# EAGLE design mainboard (EAGLE 9.6.2)
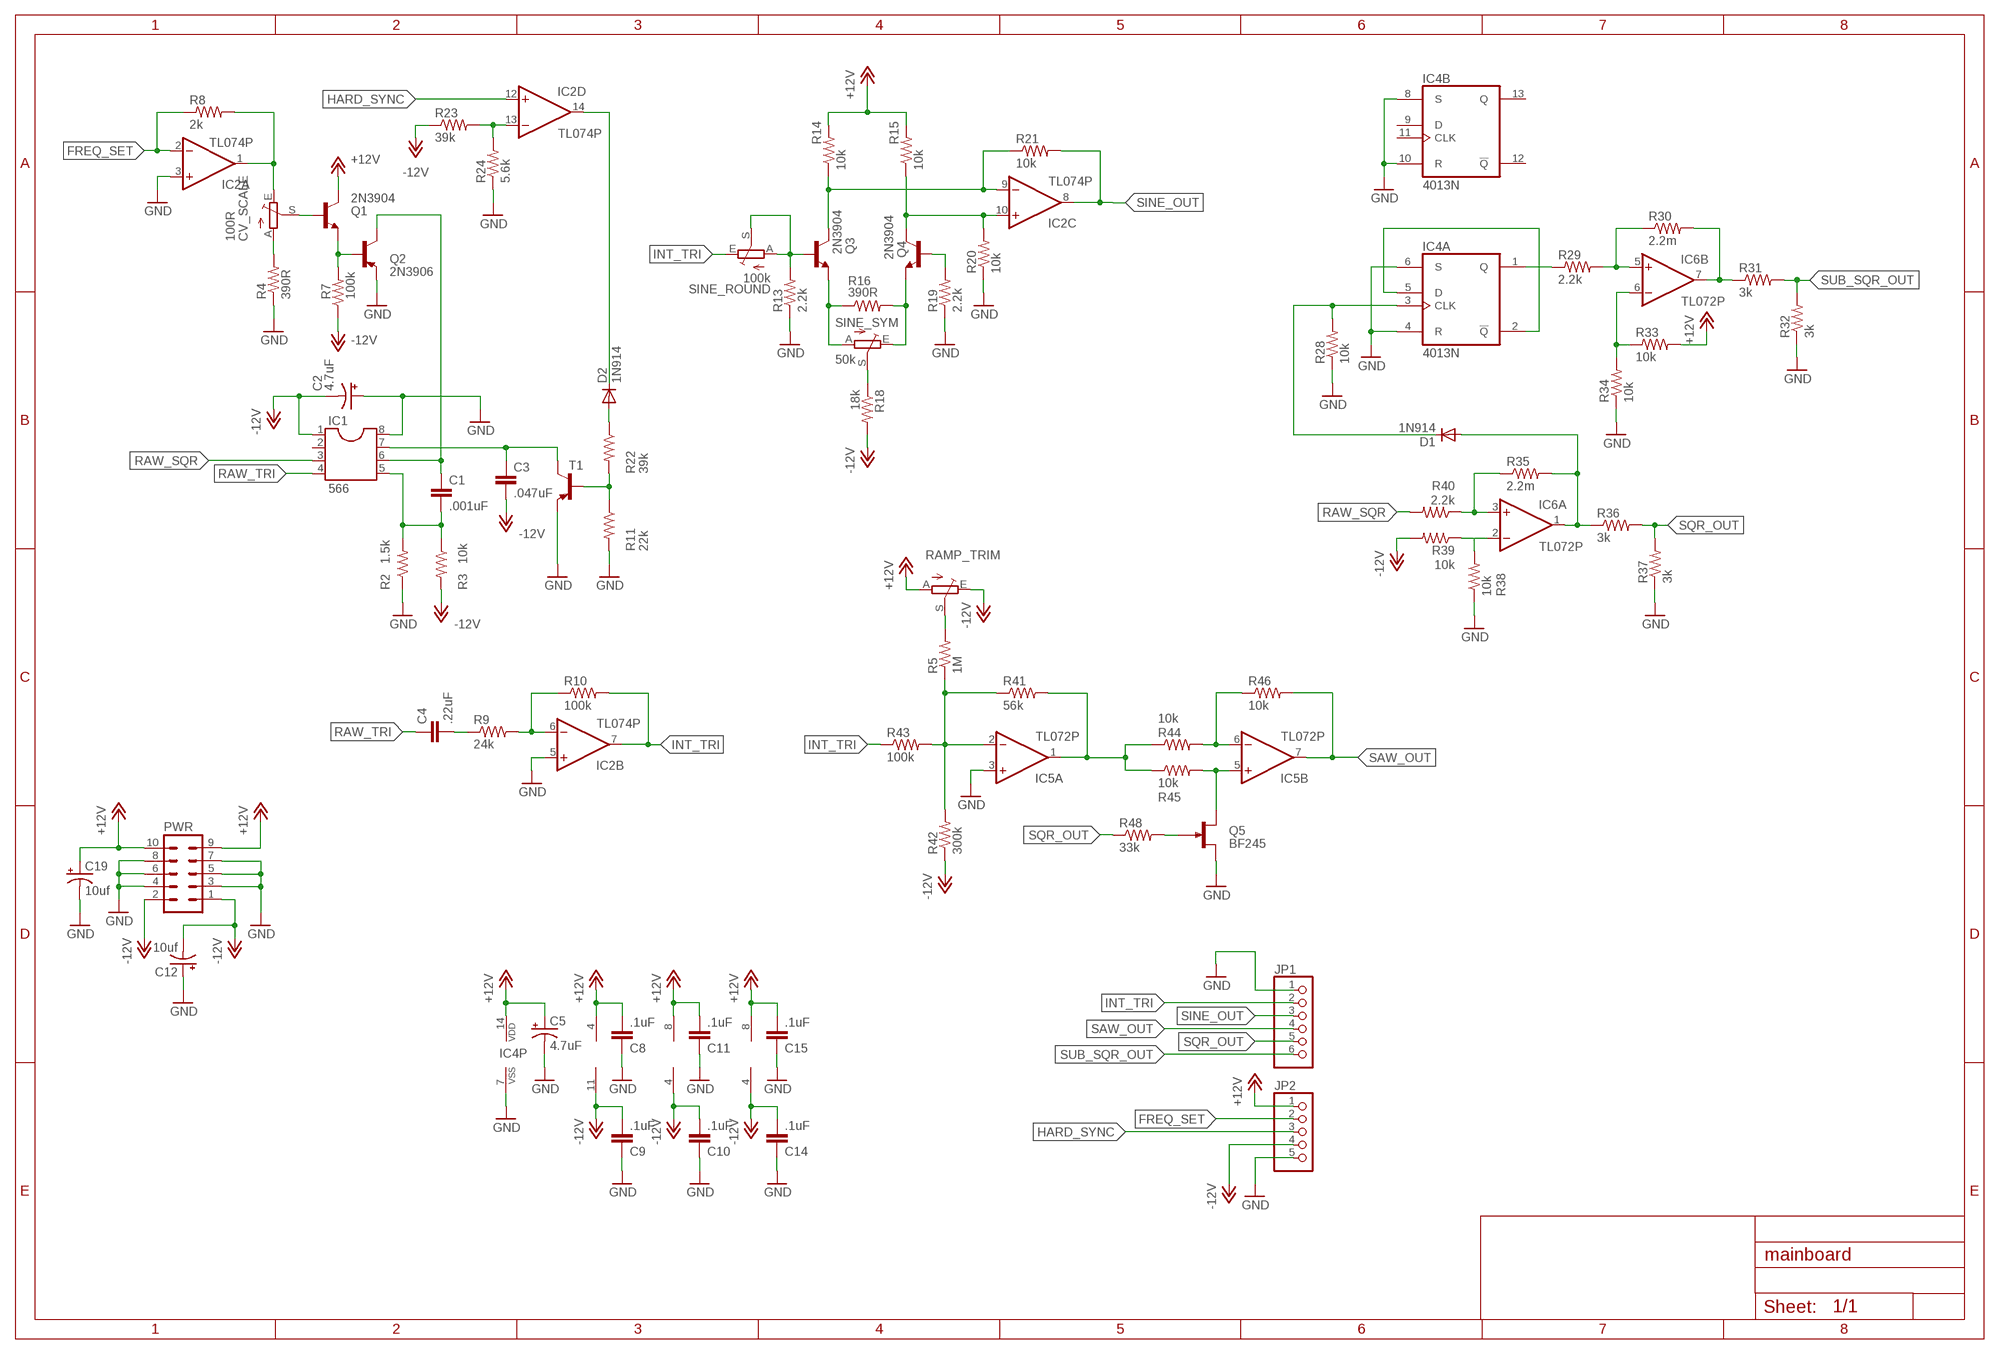
[diagram p0: schematic, sheet 1]

## Parts
C1  .001uF  C-EU050-024X044  [C050-024X044]
C2  4.7uF  CPOL-USE2.5-6  [E2,5-6]
C3  .047uF  C-EU050-024X044  [C050-024X044]
C4  .22uF  C-EU050-024X044  [C050-024X044]
C5  4.7uF  CPOL-USE2.5-5  [E2,5-5]
C8  .1uF  C-EU050-024X044  [C050-024X044]
C9  .1uF  C-EU050-024X044  [C050-024X044]
C10  .1uF  C-EU050-024X044  [C050-024X044]
C11  .1uF  C-EU050-024X044  [C050-024X044]
C12  10uf  CPOL-USE2.5-5  [E2,5-5]
C14  .1uF  C-EU050-024X044  [C050-024X044]
C15  .1uF  C-EU050-024X044  [C050-024X044]
C19  10uf  CPOL-USE2.5-5  [E2,5-5]
CV_SCALE  100R  TRIM_EU-RJ9W  [RJ9W]
D1  1N914  1N4148DO35-7  [DO35-7]
D2  1N914  1N4148DO35-7  [DO35-7]
IC1  566  DIL8  [DIL08]
IC2  TL074P  [DIL14]
IC4  4013N  [DIL14]
IC5  TL072P  [DIL08]
IC6  TL072P  [DIL08]
JP1  PINHD-1X6  [1X06]
JP2  PINHD-1X5  [1X05]
PWR  ML10  [ML10]
Q1  2N3904  [TO92]
Q2  2N3906  [TO92]
Q3  2N3904  [TO92]
Q4  2N3904  [TO92]
Q5  BF245  [SOT54C]
R2  1.5k  R-US_0204/7  [0204/7]
R3  10k  R-US_0204/7  [0204/7]
R4  390R  R-US_0204/7  [0204/7]
R5  1M  R-US_0204/7  [0204/7]
R7  100k  R-US_0204/7  [0204/7]
R8  2k  R-US_0204/7  [0204/7]
R9  24k  R-US_0204/7  [0204/7]
R10  100k  R-US_0204/7  [0204/7]
R11  22k  R-US_0204/7  [0204/7]
R13  2.2k  R-US_0204/7  [0204/7]
R14  10k  R-US_0204/7  [0204/7]
R15  10k  R-US_0204/7  [0204/7]
R16  390R  R-US_0204/7  [0204/7]
R18  18k  R-US_0204/7  [0204/7]
R19  2.2k  R-US_0204/7  [0204/7]
R20  10k  R-US_0204/7  [0204/7]
R21  10k  R-US_0204/7  [0204/7]
R22  39k  R-US_0204/7  [0204/7]
R23  39k  R-US_0204/7  [0204/7]
R24  5.6k  R-US_0204/7  [0204/7]
R28  10k  R-US_0204/7  [0204/7]
R29  2.2k  R-US_0204/7  [0204/7]
R30  2.2m  R-US_0204/7  [0204/7]
R31  3k  R-US_0204/7  [0204/7]
R32  3k  R-US_0204/7  [0204/7]
R33  10k  R-US_0204/7  [0204/7]
R34  10k  R-US_0204/7  [0204/7]
R35  2.2m  R-US_0204/7  [0204/7]
R36  3k  R-US_0204/7  [0204/7]
R37  3k  R-US_0204/7  [0204/7]
R38  10k  R-US_0204/7  [0204/7]
R39  10k  R-US_0204/7  [0204/7]
R40  2.2k  R-US_0204/7  [0204/7]
R41  56k  R-US_0204/7  [0204/7]
R42  300k  R-US_0204/7  [0204/7]
R43  100k  R-US_0204/7  [0204/7]
R44  10k  R-US_0204/7  [0204/7]
R45  10k  R-US_0204/7  [0204/7]
R46  10k  R-US_0204/7  [0204/7]
R48  33k  R-US_0204/7  [0204/7]
RAMP_TRIM  TRIM_EU-RJ9W  [RJ9W]
SINE_ROUND  100k  TRIM_EU-RJ9W  [RJ9W]
SINE_SYM  50k  TRIM_EU-RJ9W  [RJ9W]
T1  2N3906-PNP-TO92-EBC  [TO92-EBC]

## Nets
+12V: C5.+ C8.2 C11.2 C15.2 C19.+ IC2.4(P:V+) IC4.14(P:VDD) IC5.8(P:V+) IC6.8(P:V+) JP2.1 PWR.9 PWR.10 Q1.1(C) R14.2 R15.2 R33.2 RAMP_TRIM.A
-12V: C2.- C3.2 C9.2 C10.2 C12.- C14.2 IC1.1 IC2.11(P:V-) IC5.4(P:V-) IC6.4(P:V-) JP2.4 PWR.1 PWR.2 R3.2 R7.1 R18.2 R23.1 R39.2 R42.1 RAMP_TRIM.E
FREQ_SET: IC2.2(A:-IN) JP2.2 R8.1
GND: C2.+ C5.- C8.1 C9.1 C10.1 C11.1 C12.+ C14.1 C15.1 C19.- IC1.8 IC2.3(A:+IN) IC2.5(B:+IN) IC4.4(A:R) IC4.6(A:S) IC4.7(P:VSS) IC4.8(B:S) IC4.10(B:R) IC5.3(A:+IN) JP1.1 JP2.5 PWR.3 PWR.4 PWR.5 PWR.6 PWR.7 PWR.8 Q2.3(E) Q5.S R2.1 R4.1 R11.2 R13.1 R19.1 R20.1 R24.1 R28.1 R32.1 R34.1 R37.1 R38.1 T1.E
HARD_SYNC: IC2.12(D:+IN) JP2.3
INT_TRI: IC2.7(B:OUT) JP1.2 R10.2 R43.1 SINE_ROUND.E
N$1: C3.1 IC1.7 T1.C
N$2: C1.2 IC1.5 R2.2 R3.1
N$3: C1.1 IC1.6 Q2.1(C)
N$4: CV_SCALE.A R4.2
N$5: Q1.3(E) Q2.2(B) R7.2
N$6: CV_SCALE.S Q1.2(B)
N$7: CV_SCALE.E IC2.1(A:OUT) R8.2
N$8: IC2.6(B:-IN) R9.2 R10.1
N$9: C4.2 R9.1
N$10: IC5.6(B:-IN) R44.2 R46.1
N$11: R11.1 R22.2 T1.B
N$12: IC4.1(A:Q) R29.1
N$13: IC2.10(C:+IN) Q4.1(C) R15.1 R20.2
N$14: R18.1 SINE_SYM.S
N$15: Q3.2(B) R13.2 SINE_ROUND.A SINE_ROUND.S
N$16: IC2.9(C:-IN) Q3.1(C) R14.1 R21.1
N$17: Q4.2(B) R19.2
N$18: Q3.3(E) R16.1 SINE_SYM.A
N$19: Q4.3(E) R16.2 SINE_SYM.E
N$20: D2.C IC2.14(D:OUT)
N$21: IC6.5(B:+IN) R29.2 R30.1
N$22: D2.A R22.1
N$23: R5.2 RAMP_TRIM.S
N$24: IC6.6(B:-IN) R33.1 R34.2
N$25: IC4.2(A:!Q) IC4.5(A:D)
N$26: D1.C IC4.3(A:CLK) R28.2
N$27: IC6.7(B:OUT) R30.2 R31.1
N$28: IC5.2(A:-IN) R5.1 R41.1 R42.2 R43.2
N$29: D1.A IC6.1(A:OUT) R35.2 R36.1
N$30: IC2.13(D:-IN) R23.2 R24.2
N$31: IC6.2(A:-IN) R38.2 R39.1
N$32: IC6.3(A:+IN) R35.1 R40.1
N$33: IC5.1(A:OUT) R41.2 R44.1 R45.1
N$34: IC5.5(B:+IN) Q5.D R45.2
N$36: Q5.G R48.2
RAW_SQR: IC1.3 R40.2
RAW_TRI: C4.1 IC1.4
SAW_OUT: IC5.7(B:OUT) JP1.4 R46.2
SINE_OUT: IC2.8(C:OUT) JP1.3 R21.2
SQR_OUT: JP1.5 R36.2 R37.2 R48.1
SUB_SQR_OUT: JP1.6 R31.2 R32.2
Unconnected: IC1.2 IC4.9(B:D) IC4.11(B:CLK) IC4.12(B:!Q) IC4.13(B:Q)

## Library data of the parts
C1 C3 C4 C8-C11 C14 C15 = resistor:C-EU: CAPACITOR, European symbol
C2 C5 C12 C19 = resistor:CPOL-US: POLARIZED CAPACITOR, American symbol
CV_SCALE RAMP_TRIM SINE_ROUND SINE_SYM = pot:TRIM_EU-: POTENTIOMETER
D1 D2 = diode:1N4148: DIODE high speed (Philips)
IC1 = ic-package:DIL8: Dual In Line / Socket
IC2 = linear:TL074: OP AMP
IC4 = 40xx:4013: Dual D FLIP FLOP, set/reset
IC5 IC6 = TomW:TL072: OP AMP
JP1 = pinhead:PINHD-1X6: PIN HEADER
JP2 = pinhead:PINHD-1X5: PIN HEADER
PWR = con-ml:ML10: HARTING; OC_FARNELL: unknown; OC_NEWARK: unknown
Q1 Q3 Q4 = transistor-npn:2N3904: NPN Transistor
Q2 = transistor-pnp:2N3906: PNP Transistor
Q5 = transistor-small-signal:BF245: N-CHANNEL FET http://www.onsemi.com/pub/Collateral/BF245A-D.PDF
R2-R5 R7-R11 R13-R16 R18-R24 R28-R46 R48 = resistor:R-US_: RESISTOR, American symbol
T1 = transistor-neu-to92:*-PNP-: PNP Transistror

## Board
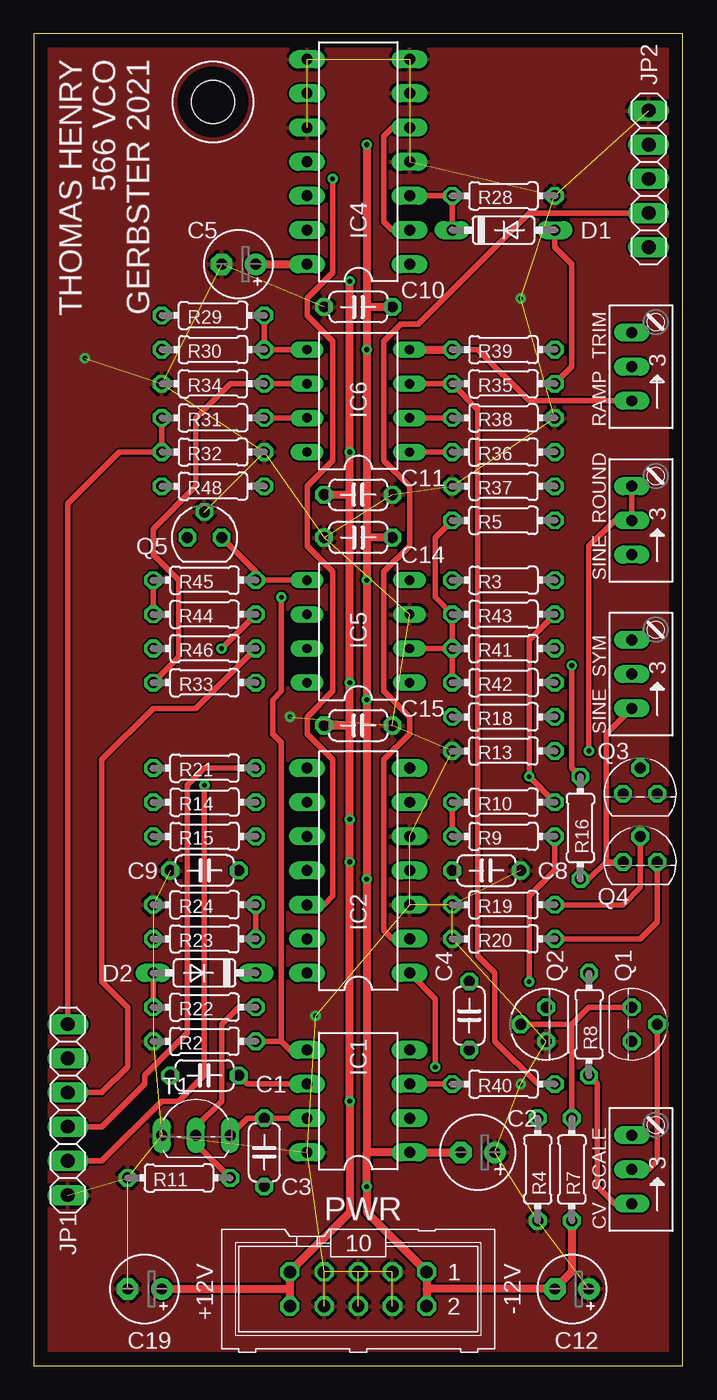
[diagram p1: board, top side]
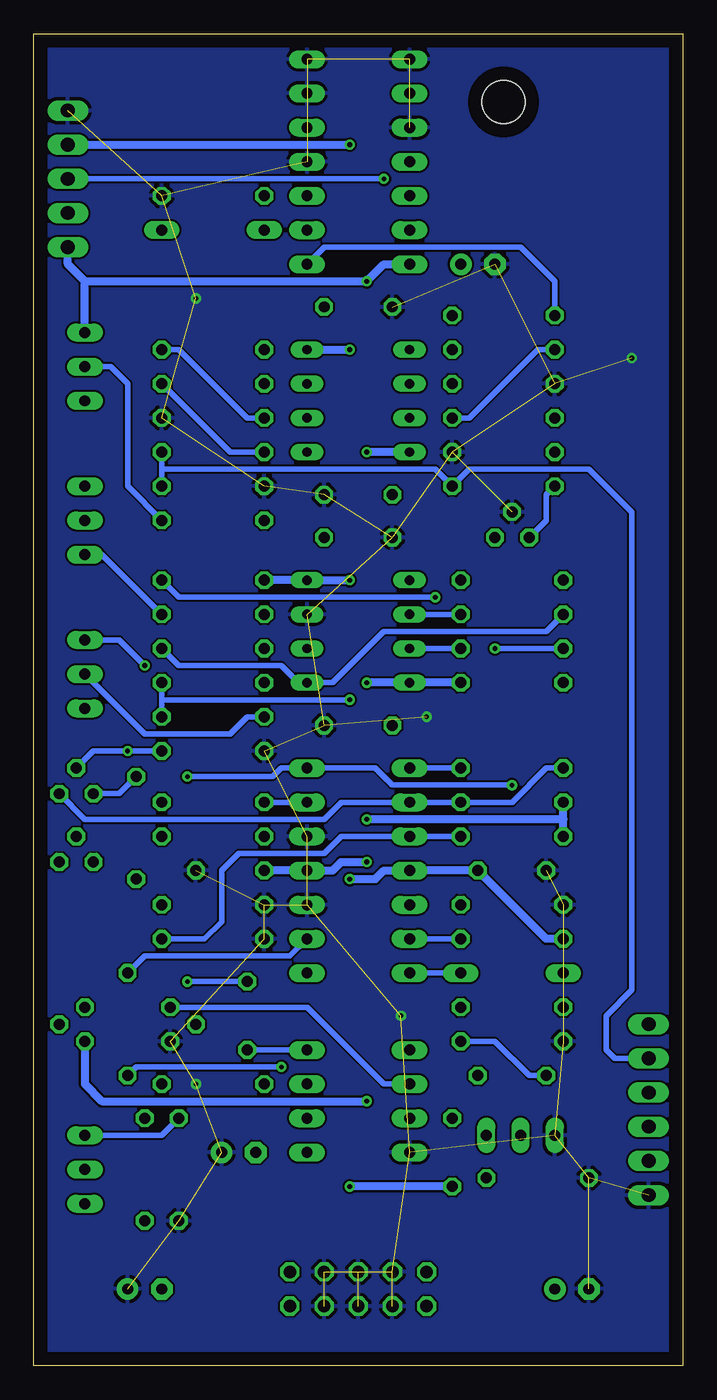
[diagram p2: board, bottom side, seen from below]

Size 48.26 x 99.06 mm. Coordinates in mm from the lower left corner, seen from the top.
Outline: 0,0 48.26,0 48.26,99.06 0,99.06 0,0
Copper layers (1*16): Top 0.035mm / dielectric 1.5mm / Bottom 0.035mm
Design rules "default": minimum track width 6mil, minimum drill 0.35mm, track to track 6mil, track to pad 6mil, pad to pad 6mil, via to via 6mil, smd to smd 6mil, copper to edge 40mil, drill to drill 6mil, minimum pad ring 10mil, minimum via ring 8mil, stop-mask expansion 4mil, vias tented up to drill 0mil, thermal gap 10mil
Holes 3.2 mm at 13.34,93.98

### Footprints (pad centres in the part's own frame; a part is rotated, then mirrored left to right if it is on the bottom)
C050-024X044 = drill 0.813 octagon: 1 -2.54,0; 2 2.54,0
E2,5-6 = drill 0.813 pad 1.6: + -1.27,0 | drill 0.813 pad 1.6 octagon: - 1.27,0
E2,5-5 = drill 0.813 pad 1.6: + -1.27,0 | drill 0.813 pad 1.6 octagon: - 1.27,0
RJ9W = drill 0.813 long: A 2.54,0.635; E -2.54,0.635; S 0,0.635
DO35-7 = drill 0.813 long: A 3.81,0; C -3.81,0
DIL08 = drill 0.813 long: 1 -3.81,-3.81; 2 -1.27,-3.81; 3 1.27,-3.81; 4 3.81,-3.81; 5 3.81,3.81; 6 1.27,3.81; 7 -1.27,3.81; 8 -3.81,3.81
DIL14 = drill 0.813 long: 1 -7.62,-3.81; 2 -5.08,-3.81; 3 -2.54,-3.81; 4 0,-3.81; 5 2.54,-3.81; 6 5.08,-3.81; 7 7.62,-3.81; 8 7.62,3.81; 9 5.08,3.81; 10 2.54,3.81; 11 0,3.81; 12 -2.54,3.81; 13 -5.08,3.81; 14 -7.62,3.81
DIL08' = drill 0.7 long: 1 -3.81,-3.81; 2 -1.27,-3.81; 3 1.27,-3.81; 4 3.81,-3.81; 5 3.81,3.81; 6 1.27,3.81; 7 -1.27,3.81; 8 -3.81,3.81
1X06 = drill 1.016 long: 1 -6.35,0; 2 -3.81,0; 3 -1.27,0; 4 1.27,0; 5 3.81,0; 6 6.35,0
1X05 = drill 1.016 long: 1 -5.08,0; 2 -2.54,0; 3 0,0; 4 2.54,0; 5 5.08,0
ML10 = drill 0.914 octagon: 1 -5.08,-1.27; 2 -5.08,1.27; 3 -2.54,-1.27; 4 -2.54,1.27; 5 0,-1.27; 6 0,1.27; 7 2.54,-1.27; 8 2.54,1.27; 9 5.08,-1.27; 10 5.08,1.27
TO92 = drill 0.813 octagon: 1 1.27,0; 2 0,1.905; 3 -1.27,0
SOT54C = drill 0.813 octagon: D 1.27,0; G -1.27,0; S 0,1.905
0204/7 = drill 0.813 octagon: 1 -3.81,0; 2 3.81,0
TO92-EBC = drill 0.813 long: B 0,-1.27; C 2.54,-1.27; E -2.54,-1.27

### Placement (x,y rotation side)
C1  12.7,21.59 180 top
C2  33.02,15.88 180 top
C3  17.14,15.88 270 top
C4  32.38,26.04 90 top
C5  15.24,81.92 180 top
C8  33.66,36.83 180 top
C9  12.7,36.83 0 top
C10  24.13,78.74 0 top
C11  24.13,64.77 180 top
C12  40.01,5.71 180 top
C14  24.13,61.59 0 top
C15  24.13,47.62 180 top
C19  8.26,5.71 180 top
CV_SCALE  45.09,14.61 90 top
D1  34.92,84.45 0 top
D2  12.7,29.21 180 top
IC1  24.13,19.68 90 top
IC2  24.13,36.83 90 top
IC4  24.13,89.53 90 top
IC5  TL072P  [DIL08']  24.13,54.61 90 top
IC6  TL072P  [DIL08']  24.13,71.75 90 top
JP1  2.54,19.05 90 top
JP2  45.72,88.27 90 top
PWR  24.13,5.71 180 top
Q1  44.45,25.4 270 top
Q2  38.1,25.4 90 top
Q3  45.09,42.55 0 top
Q4  45.09,37.47 0 top
Q5  12.7,61.59 0 top
R2  12.7,24.13 0 top
R3  34.92,58.42 180 top
R4  37.47,14.61 90 top
R5  34.92,62.87 0 top
R7  40.01,14.61 90 top
R8  41.27,25.4 270 top
R9  34.92,39.37 180 top
R10  34.92,41.91 0 top
R11  10.79,13.97 180 top
R13  34.92,45.72 0 top
R14  12.7,41.91 180 top
R15  12.7,39.37 180 top
R16  40.64,40.01 270 top
R18  34.92,48.26 0 top
R19  34.92,34.29 0 top
R20  34.92,31.75 0 top
R21  12.7,44.45 0 top
R22  12.7,26.67 0 top
R23  12.7,31.75 0 top
R24  12.7,34.29 0 top
R28  34.92,87 180 top
R29  13.34,78.11 0 top
R30  13.34,75.56 180 top
R31  13.34,70.48 180 top
R32  13.34,67.94 180 top
R33  12.7,50.8 0 top
R34  13.34,73.03 0 top
R35  34.92,73.03 0 top
R36  34.92,67.94 0 top
R37  34.92,65.41 0 top
R38  34.92,70.48 180 top
R39  34.92,75.56 180 top
R40  34.92,20.95 180 top
R41  34.92,53.34 0 top
R42  34.92,50.8 180 top
R43  34.92,55.88 180 top
R44  12.7,55.88 0 top
R45  12.7,58.42 0 top
R46  12.7,53.34 0 top
R48  13.34,65.41 180 top
RAMP_TRIM  45.09,74.3 90 top
SINE_ROUND  45.09,62.87 90 top
SINE_SYM  45.09,51.44 90 top
T1  12.06,18.41 0 top

### Tracks (layer width: path | path; a pad name or v marks a point on that pad's centre or on a via)
+12V  (via drill 0.35)
  Top 0.61: 23.5,47.62 v23.5,40.64 v23.5,37.47 v23.5,19.68 23.5,11.43 PWR.9 19.05,5.71 | 23.5,47.62 v23.5,50.8 23.5,64.77 | 23.5,64.77 v23.5,67.94 v23.5,80.64 | C5.+ IC4.14 | C15.2 23.5,47.62 | C11.2 23.5,64.77 | 19.05,5.71 PWR.10 | C19.+ 19.05,5.71
  Bottom 0.61: 44.45,80.64 45.72,81.92 JP2.1 | 44.45,80.64 v23.5,80.64 22.23,81.92 IC4.14 | v23.5,37.47 25.4,37.47 26.04,36.83 IC2.4 C8.2 | v23.5,50.8 IC5.8 R33.2 | IC6.8 v23.5,67.94 | R15.2 8.89,40.64 | 8.89,40.64 v23.5,40.64 | 8.89,40.64 R14.2 | RAMP_TRIM.A 44.45,80.64 | Q1.1 44.45,20.95 43.18,19.68 v23.5,19.68
-12V  (via drill 0.35)
  Top 0.406: R39.2 33.02,75.56 36.83,71.75 RAMP_TRIM.E
  Top 0.61: 24.77,15.88 v24.77,13.34 24.77,11.43 PWR.1 29.21,5.71 | 24.77,15.88 IC1.1 C2.- | v24.77,90.81 24.77,78.74 | 24.77,78.74 v24.77,75.56 24.77,61.59 | 24.77,61.59 v24.77,58.42 v24.77,49.53 v24.77,36.2 24.77,15.88 | C14.2 24.77,61.59 | C10.2 24.77,78.74 | IC6.4 R39.2 | R7.1 40.01,6.99 C12.- 29.21,5.71 | 29.21,5.71 PWR.2
  Bottom 0.406: R18.2 38.73,49.53 | 38.73,49.53 v24.77,49.53 | R42.1 38.73,49.53
  Bottom 0.61: JP2.4 v24.77,90.81 | v24.77,36.2 22.86,36.2 22.23,36.83 IC2.11 C9.2 10.16,31.75 R23.1 | v24.77,58.42 IC5.4 R3.2 | IC6.4 v24.77,75.56 | C3.2 v24.77,13.34
FREQ_SET
  Top 0.406: IC2.2 26.67,31.75 26.04,32.38 26.04,45.09 27.94,46.99 27.94,48.26 26.04,50.16 26.04,59.05 27.94,60.96 27.94,65.41 26.04,67.31 26.04,76.2 27.3,77.47 28.57,77.47 36.83,85.72 JP2.2
  Bottom 0.406: IC2.2 29.21,30.48 40.01,30.48 R8.1
GND  (via drill 0.35)  (46 unrouted)
  other vias: 3.81,74.93 36.2,79.38 20.95,26.04 19.05,48.26 36.2,20.95
  pour Top: 0,0 0,99.06 48.26,99.06 48.26,0
  pour Bottom: 48.26,0 48.26,99.06 0,99.06 0,98.42 0,0 1.27,0
HARD_SYNC  (via drill 0.35)
  Top 0.406: IC2.12 21.59,34.29 22.23,34.92 22.23,45.09 20.32,46.99 20.32,48.26 22.23,50.16 22.23,59.05 20.32,60.96 20.32,65.41 22.23,67.31 22.23,76.2 20.32,78.11 20.32,79.38 22.23,81.28 v22.23,88.27
  Bottom 0.406: v22.23,88.27 JP2.3
INT_TRI  (via drill 0.35)
  Top 0.406: R10.2 v36.83,43.81 36.83,53.98 R43.1 | JP1.2 5.08,15.24 9.53,19.68 10.79,19.68 12.7,21.59 v12.7,43.18
  Bottom 0.406: SINE_ROUND.E 43.18,60.33 R43.1 | v36.83,43.81 30.48,43.81 29.84,44.45 IC2.7 22.86,44.45 21.59,43.18 v12.7,43.18
N$1
  Top 0.406: IC1.7 C3.1 15.88,18.41 T1.C
N$2  (via drill 0.35)
  Top 0.406: 18.41,24.13 R2.2 | 18.41,24.13 19.05,23.5 IC1.5 | v18.41,57.15 18.41,50.16 17.78,49.53 17.78,46.99 18.41,46.35 18.41,24.13
  Bottom 0.406: C1.2 11.43,21.59 13.97,24.13 R2.2 | R3.1 37.47,57.15 v18.41,57.15
N$3
  Top 0.406: C1.1 15.88,20.95 IC1.6
  Bottom 0.406: IC1.6 22.23,20.95 27.94,26.67 Q2.1
N$4
  Bottom 0.406: R4.2 38.73,17.14 CV_SCALE.A
N$5
  Top 0.406: Q2.2 40.01,25.4 | 40.01,25.4 R7.2 | Q1.3 41.27,26.67 40.01,25.4
N$6
  Top 0.406: Q1.2 46.35,15.24 45.72,14.61 CV_SCALE.S
N$7  (via drill 0.35)
  Top 0.406: R8.2 41.91,20.95 41.91,13.34 43.18,12.06 CV_SCALE.E | IC2.1 29.84,27.3 v29.84,22.23
  Bottom 0.406: v29.84,22.23 40.64,22.23 R8.2
N$8
  Top 0.406: R10.1 R9.2
  Bottom 0.406: IC2.6 R10.1
N$9  (via drill 0.35)
  Top 0.406: R9.1 38.73,36.83 36.83,34.92 v36.83,28.57
  Bottom 0.406: v36.83,28.57 C4.2
N$10  (via drill 0.35)
  Top 0.406: R44.2 v13.97,53.34
  Bottom 0.406: IC5.6 R44.2 | v13.97,53.34 R46.1
N$11
  Top 0.406: R11.1 12.06,16.51 T1.B 12.06,17.78 13.97,19.68 13.97,25.4 15.24,26.67 R22.2
N$12
  Bottom 0.406: R29.1 9.53,80.64 12.06,83.19 26.67,83.19 IC4.1
N$13
  Top 0.406: Q4.1 46.35,33.02 45.09,31.75 R20.2
  Bottom 0.406: R15.1 IC2.10 25.4,39.37 26.67,38.1 33.02,38.1 34.29,36.83 34.29,33.02 35.56,31.75 R20.2
N$14
  Bottom 0.406: R18.1 32.38,48.26 33.66,46.99 40.01,46.99 SINE_SYM.S
N$15  (via drill 0.35)
  Top 0.406: SINE_ROUND.A SINE_ROUND.S 43.18,62.87 41.27,60.96 v41.27,45.72
  Bottom 0.406: R13.2 v41.27,45.72 43.81,45.72 Q3.2
N$16
  Bottom 0.406: R21.1 10.16,44.45 12.7,41.91 R14.1 IC2.9 25.4,41.91 26.67,40.64 44.45,40.64 Q3.1
N$17
  Top 0.406: R19.2 43.81,34.29 45.09,35.56 Q4.2
N$18  (via drill 0.35)
  Top 0.406: R16.1 40.01,44.45 v40.01,52.07
  Bottom 0.406: R16.1 41.91,42.55 Q3.3 | v40.01,52.07 41.91,53.98 SINE_SYM.A
N$19
  Top 0.406: R16.2 41.27,36.2 42.55,37.47 | SINE_SYM.E 42.55,46.99 42.55,37.47 | 42.55,37.47 Q4.3
N$20
  Bottom 0.406: IC2.14 D2.C
N$21
  Top 0.406: IC6.5 R30.1 R29.2
N$22
  Top 0.406: D2.A R22.1
N$23
  Bottom 0.406: R5.2 41.27,65.41 41.27,73.03 42.55,74.3 RAMP_TRIM.S
N$24
  Top 0.406: IC6.6 R34.2 14.61,73.03 12.06,70.48 12.06,65.41 8.89,62.23 8.89,60.33 10.79,58.42 10.79,52.7 R33.1
N$25
  Top 0.406: IC4.5 26.67,92.08 26.04,91.44 26.04,85.09 26.67,84.45 IC4.2
N$26
  Top 0.406: IC4.3 R28.2 D1.C
N$27
  Top 0.406: IC6.7 R31.1
  Bottom 0.406: R30.2 10.79,75.56 15.88,70.48 R31.1
N$28
  Top 0.406: IC5.2 R41.1 | R41.1 R43.2 29.84,57.15 29.84,61.59 R5.1 | R41.1 R42.2
N$29
  Top 0.406: IC6.1 R36.1 | D1.A 38.73,83.19 40.01,81.92 40.01,74.3 R35.2
  Bottom 0.406: R36.1 33.66,67.94 R35.2
N$30
  Top 0.406: R23.2 R24.2
  Bottom 0.406: IC2.13 R23.2
N$31
  Top 0.406: IC6.2 R38.2
  Bottom 0.406: R39.1 37.47,75.56 32.38,70.48 R38.2
N$32
  Top 0.406: IC6.3 R35.1 33.02,71.12 33.02,30.48 34.29,29.21 34.29,24.13 37.47,20.95 R40.1
N$33
  Top 0.406: R45.1 R44.1
  Bottom 0.406: R41.2 37.47,52.07 29.84,52.07 28.57,50.8 IC5.1 26.04,50.8 22.23,54.61 10.16,54.61 R44.1
N$34
  Top 0.406: IC5.5 R45.2 16.51,59.05 Q5.D
N$36
  Bottom 0.406: Q5.G 10.16,62.87 10.16,64.77 R48.2
RAW_SQR
  Top 0.406: IC1.3 R40.2
RAW_TRI
  Bottom 0.406: IC1.4 C4.1
SAW_OUT
  Top 0.406: R46.2 12.06,48.9 8.89,48.9 5.08,45.09 5.08,28.57 6.99,26.67 6.99,22.23 5.08,20.32 JP1.4
  Bottom 0.406: IC5.7 R46.2
SINE_OUT
  Top 0.406: R21.2 12.7,44.45 11.43,43.18 11.43,24.77 8.26,21.59 8.26,20.95 5.08,17.78 JP1.3
  Bottom 0.406: R21.2 IC2.8
SQR_OUT
  Bottom 0.406: R36.2 38.73,66.67 | 38.73,66.67 R37.2 | 38.73,66.67 18.41,66.67 R48.1 15.88,66.67 6.99,66.67 3.81,63.5 3.81,27.94 5.71,26.04 5.71,23.5 5.08,22.86 JP1.5
SUB_SQR_OUT
  Top 0.406: R31.2 R32.2 6.35,67.94 2.54,64.14 JP1.6

### Text on the board
tNames: THOMAS HENRY / 566 VCO / GERBSTER 2021 | +12V | -12V